# Altium project Servo-Board-v1.0.PrjPcb (part 3 of 19)

## Sheet RJ45_Sheet.SchDoc
size 420 x 297 mm; SheetNumber: 6; SheetTotal: 32
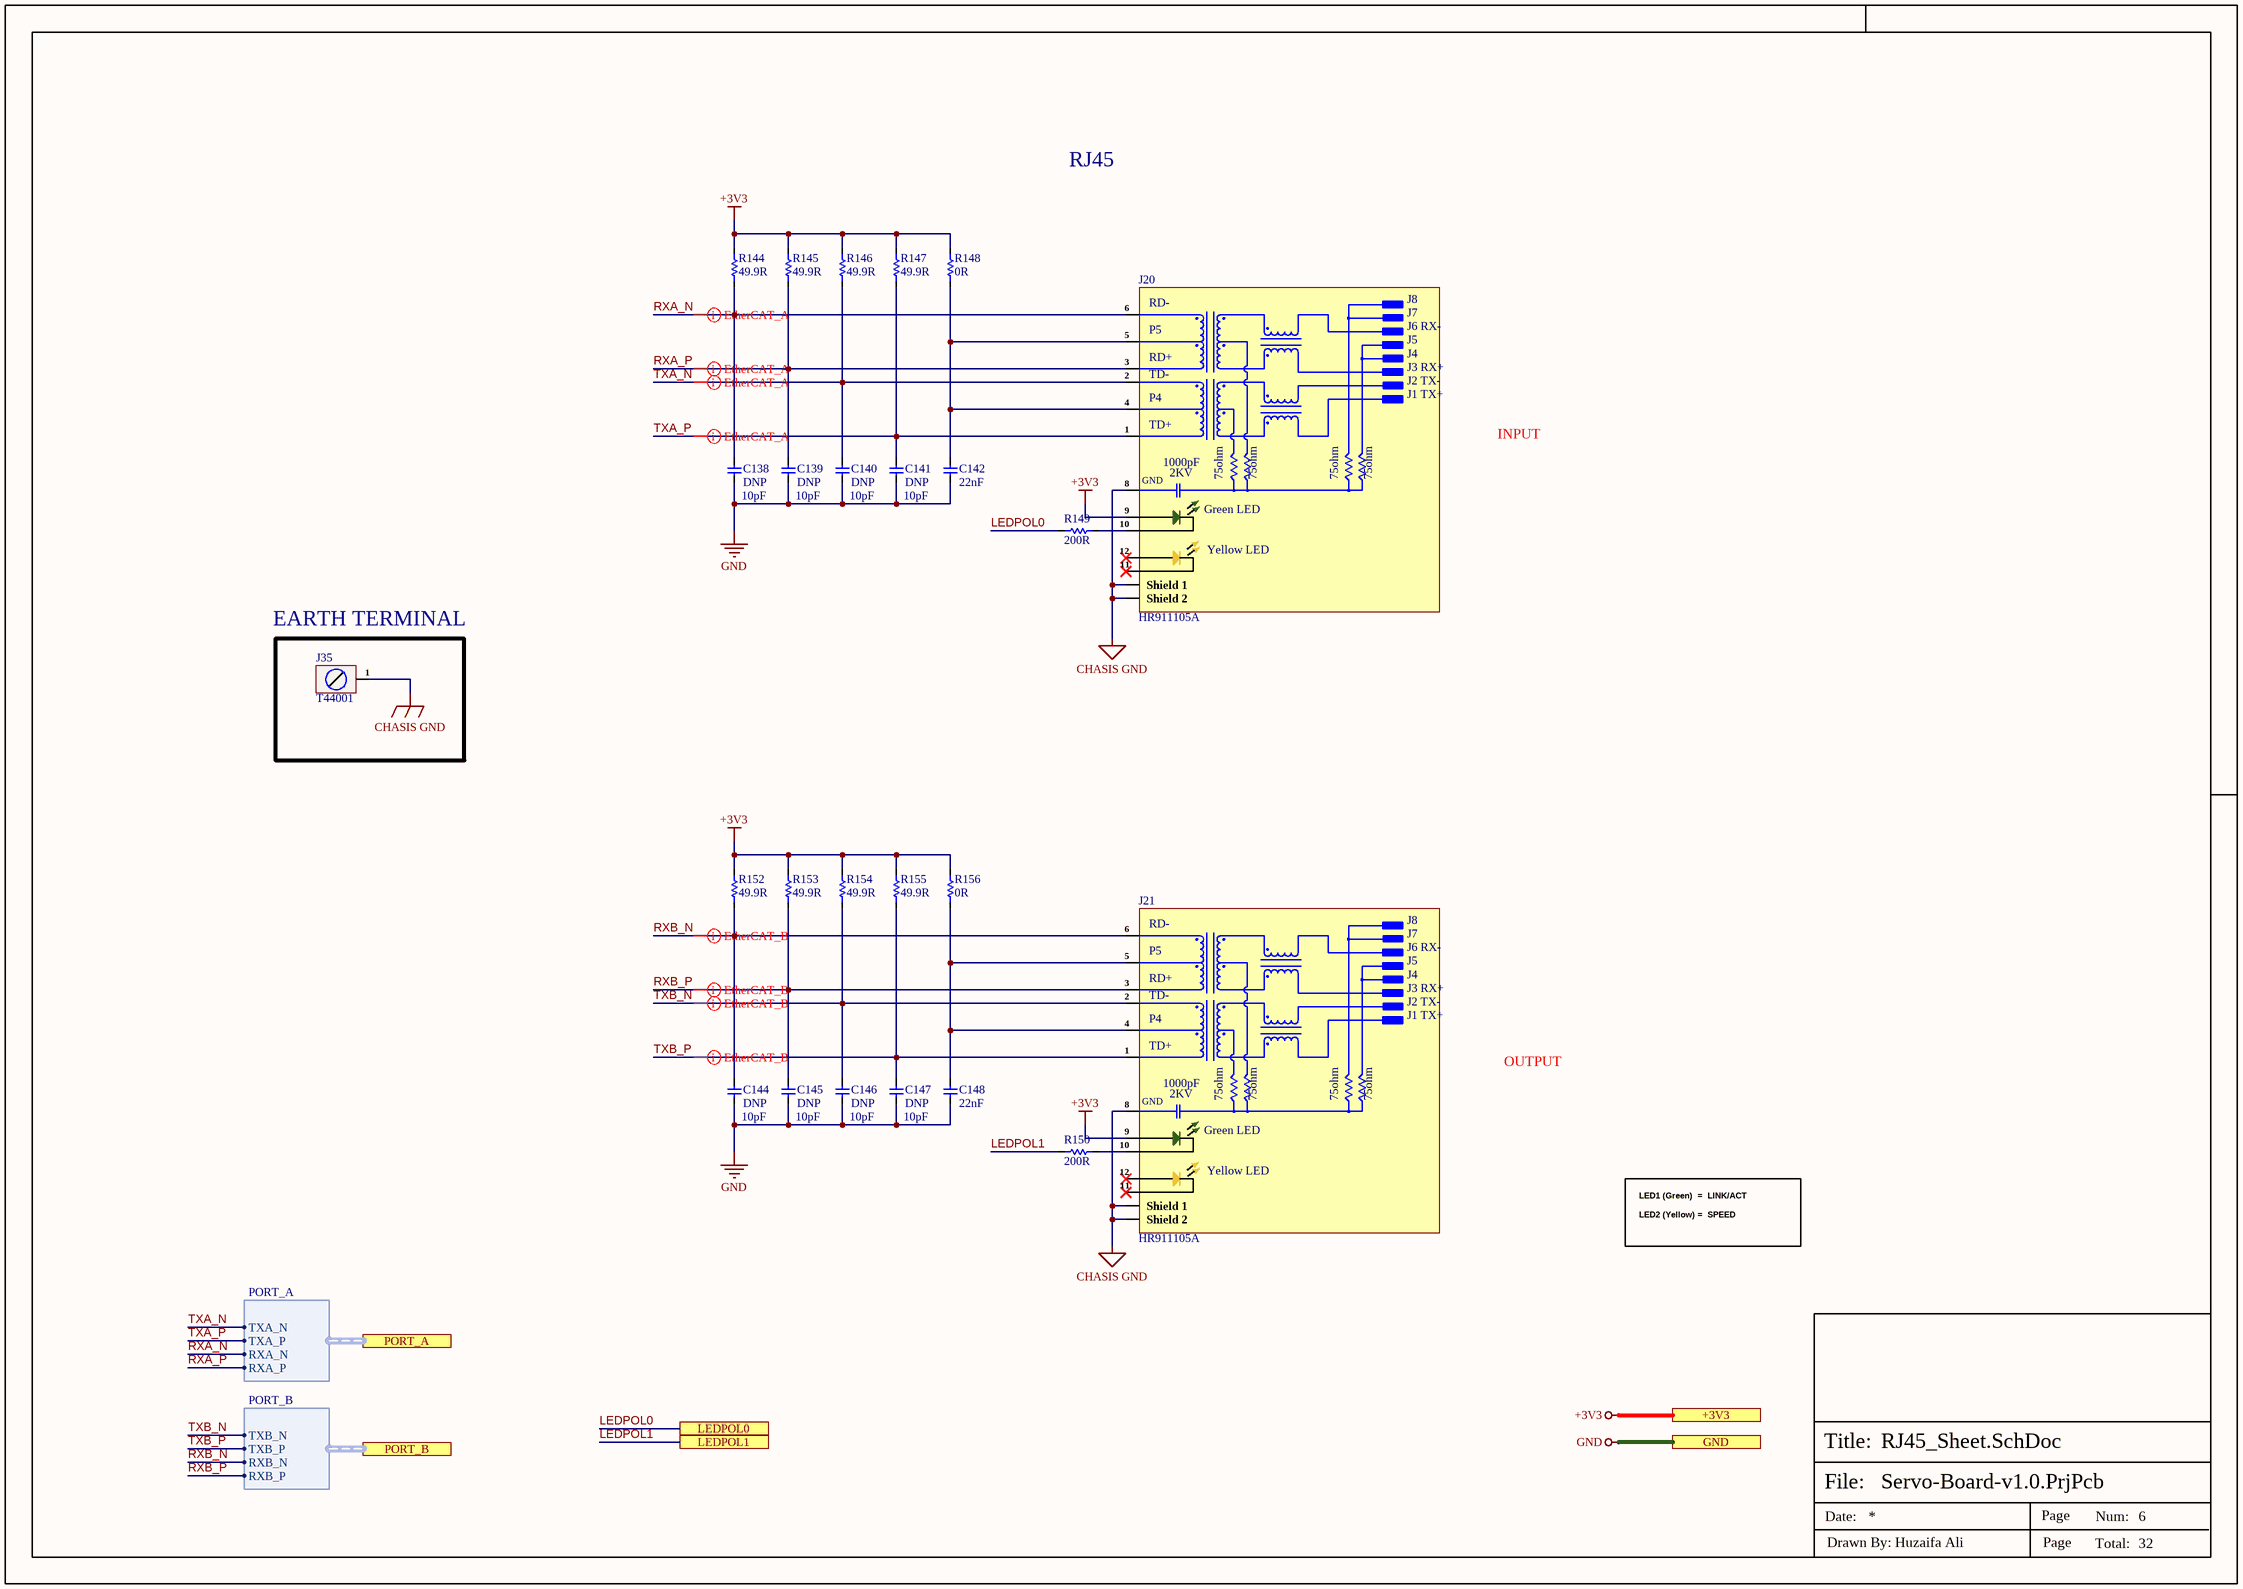
[diagram p5: RJ45_Sheet.SchDoc]

### Parts
C138  DNP  [Cap-0402]
C139  DNP  [Cap-0402]
C140  DNP  [Cap-0402]
C141  DNP  [Cap-0402]
C142  22nF  [Cap-0402]
C144  DNP  [Cap-0402]
C145  DNP  [Cap-0402]
C146  DNP  [Cap-0402]
C147  DNP  [Cap-0402]
C148  22nF  [Cap-0402]
J20  HR911105A  [HR911105A]
J21  HR911105A  [HR911105A]
J35  T44001  [T44001]
R144  49.9R  [Res-0603]
R145  49.9R  [Res-0603]
R146  49.9R  [Res-0603]
R147  49.9R  [Res-0603]
R148  0R  [Res-0402]
R149  200R  [Res-0402]
R150  200R  [Res-0402]
R152  49.9R  [Res-0603]
R153  49.9R  [Res-0603]
R154  49.9R  [Res-0603]
R155  49.9R  [Res-0603]
R156  0R  [Res-0402]

### Ports
+3V3 (see Top_Sheet[2C], CAN_Sheet[5D], Connector_Sheet[5D], Controller_Sheet[5D], Encoder_Sheet1[5D], Encoder_Sheet2[5D], Encoder_Sheet3[5D], Encoder_Sheet4[5D], EtherCAT_Sheet[5D], Motor_Driver_Sheet1[5D], Motor_Driver_Sheet2[5D], Motor_Driver_Sheet3[5D], Motor_Driver_Sheet4[5D], Power_Sheet[5D], RS485_RS232_Sheet[3D], Sec_Controller_Sheet1[5D], Sec_Controller_Sheet2[5D], Sec_Controller_Sheet3[5D], Sec_Controller_Sheet4[5D]), GND (see Top_Sheet[2C], CAN_Sheet[5D], Connector_Sheet[5D], Controller_Sheet[5D], DIO_1[5D], DIO_2[5D], DIO_3[5D], DIO_4[5D], Encoder_Sheet1[5D], Encoder_Sheet2[5D], Encoder_Sheet3[5D], Encoder_Sheet4[5D], EtherCAT_Sheet[5D], MOSFET_Driver_Sheet1[5D], MOSFET_Driver_Sheet2[5D], MOSFET_Driver_Sheet3[5D], MOSFET_Driver_Sheet4[5D], Motor_Driver_Sheet1[5D], Motor_Driver_Sheet2[5D], Motor_Driver_Sheet3[5D], Motor_Driver_Sheet4[5D], Power_Sheet[5D], RS485_RS232_Sheet[3D], Sec_Controller_Sheet1[5D], Sec_Controller_Sheet2[5D], Sec_Controller_Sheet3[5D], Sec_Controller_Sheet4[5D]), LEDPOL0 (see Top_Sheet[2D], EtherCAT_Sheet[1D]), LEDPOL1 (see Top_Sheet[2D], EtherCAT_Sheet[1D]), PORT_A (harness PORT_A, see Top_Sheet[2D], EtherCAT_Sheet[2D]), PORT_B (harness PORT_B, see Top_Sheet[2D], EtherCAT_Sheet[2D])

### Harnesses
PORT_A: TXA_N, TXA_P, RXA_N, RXA_P
PORT_B: TXB_N, TXB_P, RXB_N, RXB_P

### Nets
+3V3: J20.9(ANODE) J21.9(ANODE) R144.2 R145.2 R146.2 R147.2 R148.2 R152.2 R153.2 R154.2 R155.2 R156.2 ; port +3V3
CHASIS GND: J20.8(GND) J20.Shield_1 J20.Shield_2 J21.8(GND) J21.Shield_1 J21.Shield_2 J35.1
GND: C138.1 C139.1 C140.1 C141.1 C142.1 C144.1 C145.1 C146.1 C147.1 C148.1 ; port GND
LEDPOL0: R149.1 ; port LEDPOL0
LEDPOL1: R150.1 ; port LEDPOL1
RXA_N: C138.2 J20.6(RD-) R144.1 ; port PORT_A.RXA_N
RXA_P: C139.2 J20.3(RD+) R145.1 ; port PORT_A.RXA_P
RXB_N: C144.2 J21.6(RD-) R152.1 ; port PORT_B.RXB_N
RXB_P: C145.2 J21.3(RD+) R153.1 ; port PORT_B.RXB_P
TXA_N: C140.2 J20.2(TD-) R146.1 ; port PORT_A.TXA_N
TXA_P: C141.2 J20.1(TD+) R147.1 ; port PORT_A.TXA_P
TXB_N: C146.2 J21.2(TD-) R154.1 ; port PORT_B.TXB_N
TXB_P: C147.2 J21.1(TD+) R155.1 ; port PORT_B.TXB_P
NetC142_2: C142.2 J20.4(P4) J20.5(P5) R148.1
NetC148_2: C148.2 J21.4(P4) J21.5(P5) R156.1
NetJ20_10: J20.10(CATHODE) R149.2
NetJ21_10: J21.10(CATHODE) R150.2

Not connected (* = marked no-connect by the designer): J20 11(CATHODE)* 12(ANODE_)*; J21 11(CATHODE)* 12(ANODE_)*

### Layout directives
differential pair; differential pair class EtherCAT_B_Lines; net class EtherCAT_B; rule Matched Net Lengths [Tolerance = 25.4mil]; rule Impedance Constraint [Min = 85.00    Max = 95.00    ]: RXB_N, RXB_P, TXB_N, TXB_P
differential pair; differential pair class EtherCAT_A_Lines; net class EtherCAT_A; rule Matched Net Lengths [Tolerance = 25.4mil]; rule Impedance Constraint [Min = 85.00    Max = 95.00    ]: RXA_N, RXA_P, TXA_N, TXA_P

### Notes on the sheet
- RJ45
- INPUT
- 10pF
- (near J35) EARTH TERMINAL
- OUTPUT
- LED1 (Green)  =  LINK/ACT
  LED2 (Yellow) =  SPEED
- File:
- Title:
- Date:
- Page
- Num:
- Total:
- Drawn By: Huzaifa Ali
- (in symbol HR911105A) J8; J7; J6 RX-; J5; J4; J3 RX+; J2 TX-; J1 TX+; 1000pF; 2KV; 75ohm; Green LED; Yellow LED

### Library data of the parts
C138-C141 C144-C147 = GRM1555C1H100JA01D: CAP CER 10PF 50V C0G/NP0 0402; Manufacturer: Murata; Material: Ceramic; Dielectric: C0G; Tolerance: 5%; Item Type: Capacitor; Supplier: Arrow Electronics; Supplier Part Number: GRM1555C1H100JA01D; Manufacturer Part Number: GRM1555C1H100JA01D; RoHS: Yes; Category: Ceramic Capacitors; Stock: 3860000; Pricing: 10000=0.0034, 50000=0.0027, 100000=0.0023, 250000=0.0021 (USD); Mounting Technology: Surface Mount; Case/Package: 0402; Case Code (Metric): 1005; Case Code (Imperial): 0402; Min Operating Temperature: -55°C; Max Operating Temperature: 125°C; Value: 10pF; Voltage Rating: 50V; Packaging: Tape and Reel; Package Quantity: 1; Voltage Rating (DC): 50V; Termination: SMD/SMT; Series: GRM; Voltage: 50V; Construction: Flat; Length: 1mm; Width: 0.02inch; Height: 0.5mm; Depth: 0.5mm; Thickness: 0.022inch; Radiation Hardening: No; RoHS Compliant: Yes; Lead Free: Lead Free; Reach SVHC Compliant: No; ComponentLink1URL: https://datasheet.ciiva.com/2989/product-2989280.pdf?src-supplier=Avnet; ComponentLink1Description: https://datasheet.ciiva.com/2989/product-2989280.pdf?src-supplier=Avnet; ComponentLink2URL: https://datasheet.ciiva.com/18184/getdatasheetpartid-307234-18184164.pdf?src-supplier=Verical; ComponentLink2Description: https://datasheet.ciiva.com/18184/getdatasheetpartid-307234-18184164.pdf?src-supplier=Verical; ComponentLink3URL: https://datasheet.ciiva.com/29200/453545-da-01-en-vs-kondensator-0402-29200107.pdf?src-supplier=Conrad; ComponentLink3Description: https://datasheet.ciiva.com/29200/453545-da-01-en-vs-kondensator-0402-29200107.pdf?src-supplier=Conrad; ComponentLink4URL: https://datasheet.ciiva.com/7828/1666664-7828812.pdf?src-supplier=Element14; ComponentLink4Description: https://datasheet.ciiva.com/7828/1666664-7828812.pdf?src-supplier=Element14; ComponentLink5URL: https://datasheet.ciiva.com/6271/partnumbering-e-01-6271159.pdf?src-supplier=Digi-Key; ComponentLink5Description: https://datasheet.ciiva.com/6271/partnumbering-e-01-6271159.pdf?src-supplier=Digi-Key; ComponentLink6URL: https://datasheet.ciiva.com/6271/partnumbering-e-01-6271158.pdf?src-supplier=Digi-Key; ComponentLink6Description: https://datasheet.ciiva.com/6271/partnumbering-e-01-6271158.pdf?src-supplier=Digi-Key; ComponentLink7URL: https://datasheet.ciiva.com/6271/partnumbering-e-01-6271068.pdf?src-supplier=Digi-Key; ComponentLink7Description: https://datasheet.ciiva.com/6271/partnumbering-e-01-6271068.pdf?src-supplier=Digi-Key; LCSC Part Number: C76946
C142 C148 = CC0402JRX7R7BB223: CAP CER 0.022UF 16V X7R 0402; Manufacturer: Yageo; Tolerance: 5%; Item Type: Capacitor; Supplier: Digikey; Supplier Part Number: 311-3758-1-ND; Manufacturer Part Number: CC0402JRX7R7BB223; RoHS: Yes; Category: Ceramic Capacitors; Stock: 4203; Pricing: 1=0.1, 10=0.033, 50=0.0192, 100=0.0149, 500=0.0112, 1000=0.0088, 2500=0.008, 5000=0.00736 (USD); Mounting Technology: Surface Mount; Case/Package: 0402; Case Code (Imperial): 0402; Case Code (Metric): 1005; Weight: 2.3E-05oz; Min Operating Temperature: -55°C; Max Operating Temperature: 125°C; Value: 22nF; Packaging: Tape and Reel; Voltage Rating: 16V; Voltage Rating (DC): 16V; Dielectric: X7R; Termination: SMD/SMT; Series: CC; Length: 0.039inch; Width: 0.5mm; Thickness: 0.022inch; RoHS Compliant: Yes; Halogen Free: 5694HalogenFree; Lead Free: 5697LeadFree; ComponentLink1URL: https://datasheet.ciiva.com/13264/upy-gphc-x7r-6-3v-to-50v-8-12304-13264039.pdf?src-supplier=Mouser; ComponentLink1Description: https://datasheet.ciiva.com/13264/upy-gphc-x7r-6-3v-to-50v-8-12304-13264039.pdf?src-supplier=Mouser; LCSC Part Number: C541459
J20 J21 = HR911105A: RJ45 RJReceptacle 1 WithLED Plugin Ethernet Connectors/Modular Connectors (RJ45 RJ11) ROHS; Manufacturer: HANRUN; Item Type: RJ45 Connector; Manufacturer Part Number: HR911105A; Package: Plugin; LCSC Part Number: C12074; ComponentLink1Description: LCSC; ComponentLink1URL: https://www.lcsc.com/product-detail/Ethernet-Connectors-Modular-Connectors-RJ45-RJ11_HANRUN-Zhongshan-HanRun-Elec-HR911105A_C12074.html
J35 = T44001: M4 Plugin PCB Welding Terminal ROHS; Manufacturer: XFCN; Manufacturer Part Number: T44001; Package: Plugin; ComponentLink1Description: LCSC; ComponentLink1URL: *
R144-R147 R152-R155 = RC0603FR-0749R9L: RES 49.9 OHM 1% 1/10W 0603; Manufacturer: Yageo; Temperature Coefficient: 100ppm/°C; Voltage Rating (DC): 50V; Power Rating: 100mW; Item Type: Resistor; Supplier 1: Arrow Electronics; Manufacturer Part Number: RC0603FR-0749R9L; RoHS: Yes; Category: Chip SMD Resistors; Stock 1: 2075000; Pricing 1: 5000=0.00280 (USD); Case/Package: 0603; Number of Pins: 2; Case Code (Imperial): 0603; Case Code (Metric): 1608; Size Code: 0603; Min Operating Temperature: -55°C; Max Operating Temperature: 155°C; Tolerance: 1%; Resistance: 49.9R; Resistor Type: Thick Film; Packaging: Tape and Reel; Voltage Rating: 50V; Termination: SMD/SMT; Features: Moisture Resistant; Series: RC; Max Power Dissipation: 100mW; Number of Terminations: 2; Construction: Rectangular; Resistance Tolerance: 1%; Technology: THICK FILM; Length: 1.6mm; Height: 0.45mm; Depth: 0.8mm; Lead Free: Lead Free; REACH SVHC: No SVHC; Military Standard: Not; RoHS Compliant: Yes; ComponentLink1URL: https://datasheet.ciiva.com/11808/0900766b80f96399-11808223.pdf?src-supplier=RSComponents; ComponentLink1Description: https://datasheet.ciiva.com/11808/0900766b80f96399-11808223.pdf?src-supplier=RSComponents; ComponentLink2URL: https://datasheet.ciiva.com/22747/443971-22747527.pdf?src-supplier=Element14; ComponentLink2Description: https://datasheet.ciiva.com/22747/443971-22747527.pdf?src-supplier=Element14; ComponentLink3URL: https://datasheet.ciiva.com/15189/getdatasheetpartid-325421-15189750.pdf?src-supplier=Verical; ComponentLink3Description: https://datasheet.ciiva.com/15189/getdatasheetpartid-325421-15189750.pdf?src-supplier=Verical; Supplier Part Number 1: RC0603FR-0749R9L; LCSC Part Number: C114625
R148 R156 = AC0402FR-070RL: RESISTOR 0402 JUMPER ZERO OHM; Manufacturer: Yageo; Voltage Rating: 50V; Power Rating: 62.5mW; Tolerance: 1%; Temperature Coefficient: 200ppm/°C; Supplier: Digi-Key; Supplier Part Number: 13-AC0402FR-070RLDKR-ND; Manufacturer Part Number: AC0402FR-070RL; RoHS: Yes; Category: Chip SMD Resistors; Stock: 337140; Pricing: 1=0.1, 10=0.017, 25=0.0132, 50=0.01, 100=0.0071, 250=0.00568, 500=0.00454, 1000=0.00335, 5000=0.0024 (USD); Case/Package: 0402; Case Code (Imperial): 0402; Case Code (Metric): 1005; Min Operating Temperature: -55°C; Max Operating Temperature: 155°C; Value: 0R; Packaging: Tape and Reel; Termination: SMD/SMT; Series: AC; Height: 370um; ComponentLink1URL: https://datasheet.ciiva.com/12656/pyu-ac-51-rohs-l-2-12656734.pdf?src-supplier=Mouser; ComponentLink1Description: https://datasheet.ciiva.com/12656/pyu-ac-51-rohs-l-2-12656734.pdf?src-supplier=Mouser; LCSC Part Number: C226739; Item Type: Resistor; ComponentLink2Description: LCSC; ComponentLink2URL: https://www.lcsc.com/product-detail/Chip-Resistor-Surface-Mount_YAGEO-AC0402FR-070RL_C226739.html
R149 R150 = RC0402FR-07200RL: as R17 on sheet Power_Sheet; Supplier 1: Digi-Key; Manufacturer Part Number: RC0402FR-07200RL; RoHS: Yes; Category: Chip SMD Resistors; Stock 1: 19778; Pricing 1: 1=0.10000, 10=0.01600, 100=0.00660, 1000=0.00299, 2500=0.00259, 5000=0.00214 (USD); Case/Package: 0402; Case Code (Metric): 1005; Case Code (Imperial): 0402; Size Code: 0402; Min Operating Temperature: -55°C; Max Operating Temperature: 155°C; Tolerance: 1%; Resistance: 200R; Resistor Type: Thick Film; Packaging: Tape and Reel; Voltage Rating: 50V; Package Quantity: 1; Number of Terminations: 2; Termination: SMD/SMT; Max Power Dissipation: 63mW; Features: Moisture Resistant; Series: RC; Construction: Rectangular; Resistance Tolerance: 1%; Length: 1mm; Width: 0.02inch; Height: 0.016inch; Depth: 0.5mm; REACH SVHC: No SVHC; Lead Free: Lead Free; RoHS Compliant: Yes; Military Standard: Not; ComponentLink1URL: https://datasheet.ciiva.com/2553/pyu-r-int-thick-7-2553232.pdf?src-supplier=Digi-Key; ComponentLink1Description: https://datasheet.ciiva.com/2553/pyu-r-int-thick-7-2553232.pdf?src-supplier=Digi-Key; ComponentLink2URL: https://datasheet.ciiva.com/7983/1018594-7983509.pdf?src-supplier=Element14; ComponentLink2Description: https://datasheet.ciiva.com/7983/1018594-7983509.pdf?src-supplier=Element14; ComponentLink3URL: https://datasheet.ciiva.com/16804/pyu-rc0402-51-rohs-l-6-r-16804406.pdf?src-supplier=Future+Electronics; ComponentLink3Description: https://datasheet.ciiva.com/16804/pyu-rc0402-51-rohs-l-6-r-16804406.pdf?src-supplier=Future+Electronics; ComponentLink4URL: https://datasheet.ciiva.com/15189/getdatasheetpartid-331152-15189383.pdf?src-supplier=Verical; ComponentLink4Description: https://datasheet.ciiva.com/15189/getdatasheetpartid-331152-15189383.pdf?src-supplier=Verical; ComponentLink5URL: https://datasheet.ciiva.com/7849/1018594-7849898.pdf?src-supplier=Element14; ComponentLink5Description: https://datasheet.ciiva.com/7849/1018594-7849898.pdf?src-supplier=Element14; ComponentLink6URL: https://datasheet.ciiva.com/5562/pyu-rc0402-51-rohs-l-6-r-8721-5562539.pdf?src-supplier=Mouser; ComponentLink6Description: https://datasheet.ciiva.com/5562/pyu-rc0402-51-rohs-l-6-r-8721-5562539.pdf?src-supplier=Mouser; ComponentLink7URL: https://datasheet.ciiva.com/7849/1018594-7849899.pdf?src-supplier=Element14; ComponentLink7Description: https://datasheet.ciiva.com/7849/1018594-7849899.pdf?src-supplier=Element14; ComponentLink8URL: https://datasheet.ciiva.com/2553/pyu-r-int-thick-7-2553230.pdf?src-supplier=Digi-Key; ComponentLink8Description: https://datasheet.ciiva.com/2553/pyu-r-int-thick-7-2553230.pdf?src-supplier=Digi-Key; ComponentLink9URL: https://datasheet.ciiva.com/2553/pyu-r-int-thick-7-2553231.pdf?src-supplier=Digi-Key; ComponentLink9Description: https://datasheet.ciiva.com/2553/pyu-r-int-thick-7-2553231.pdf?src-supplier=Digi-Key; Supplier Part Number 1: 311-200LRCT-ND; LCSC Part Number: C114764

## Sheet EtherCAT_Sheet.SchDoc
size 420 x 297 mm; SheetNumber: 7; SheetTotal: 32
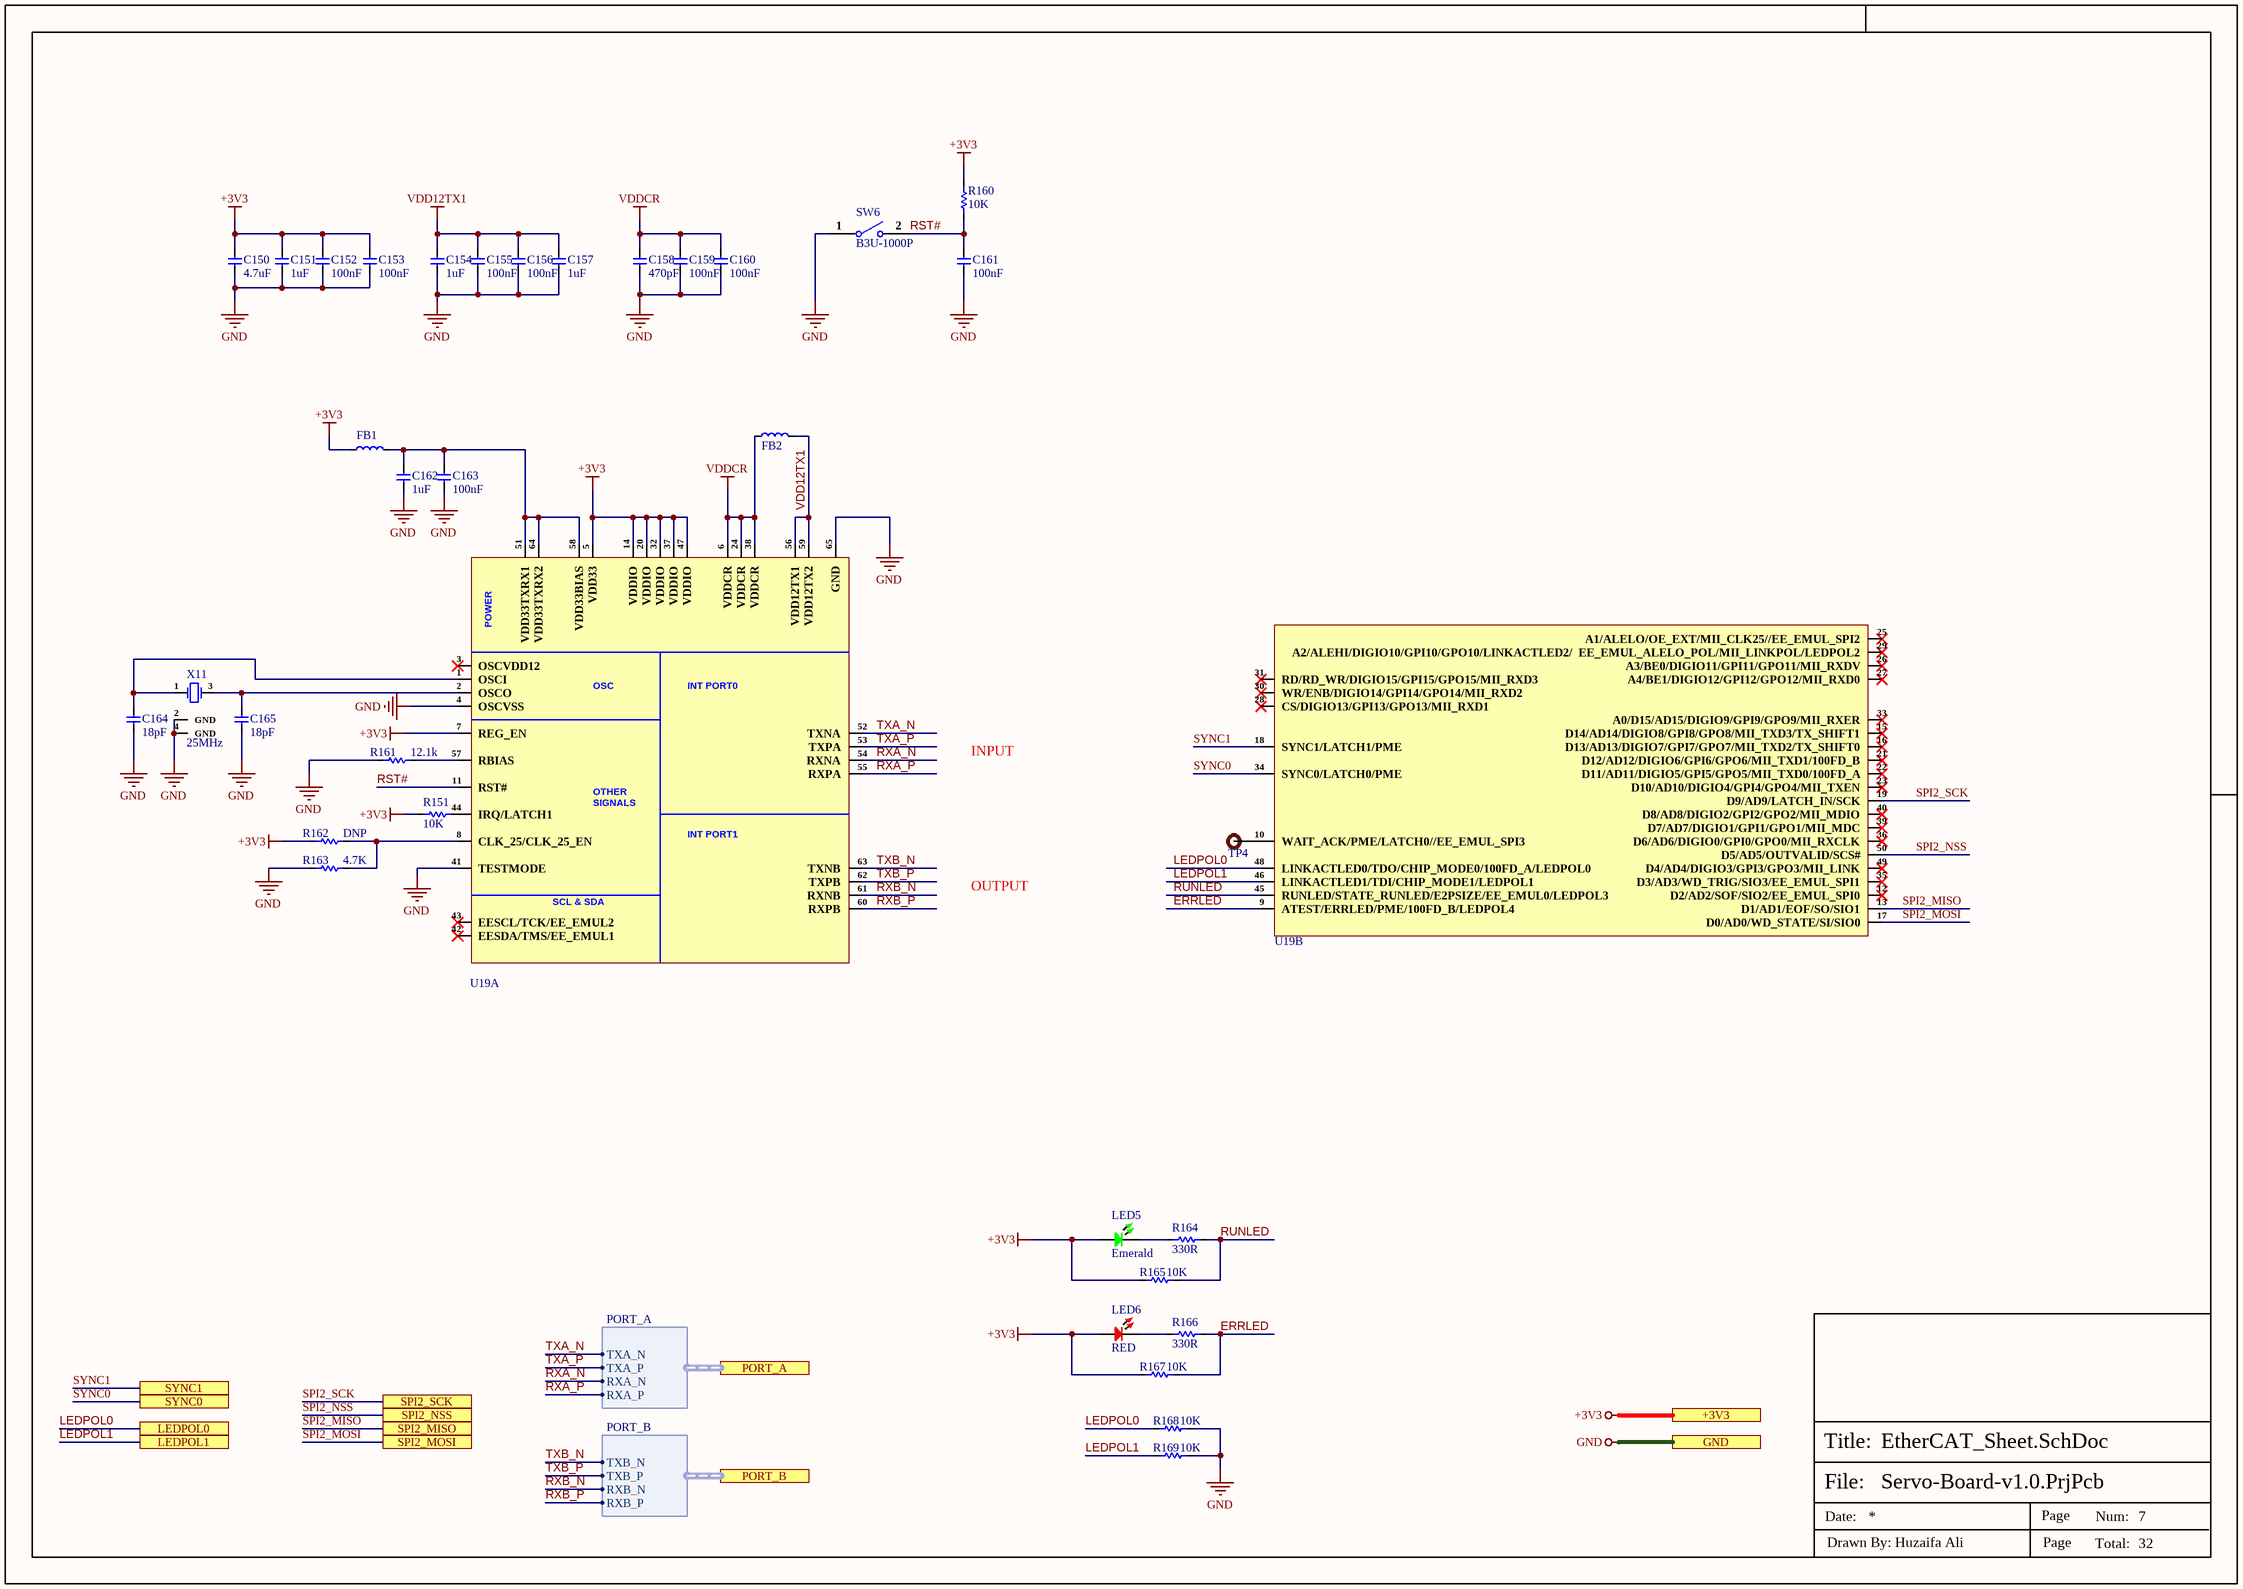
[diagram p6: EtherCAT_Sheet.SchDoc]

### Parts
C150  4.7uF  [Cap-0402]
C151  1uF  [Cap-0402]
C152  100nF  [cap-0402]
C153  100nF  [cap-0402]
C154  1uF  [Cap-0402]
C155  100nF  [cap-0402]
C156  100nF  [cap-0402]
C157  1uF  [Cap-0402]
C158  470pF  [Cap-0603]
C159  100nF  [cap-0402]
C160  100nF  [cap-0402]
C161  100nF  [cap-0402]
C162  1uF  [Cap-0402]
C163  100nF  [cap-0402]
C164  18pF  [Cap-0402]
C165  18pF  [Cap-0402]
FB1  BLM15PG100SN1D  [IND-0402]  (value not drawn)
FB2  BLM15PG100SN1D  [IND-0402]  (value not drawn)
LED5  Emerald  [LED-0603]
LED6  RED  [LED-0603]
R151  10K  [Res-0402]
R160  10K  [Res-0402]
R161  12.1k  [Res-0402]
R162  DNP  [Res-0402]
R163  4.7K  [Res-0402]
R164  330R  [Res-0603]
R165  10K  [Res-0402]
R166  330R  [Res-0603]
R167  10K  [Res-0402]
R168  10K  [Res-0402]
R169  10K  [Res-0402]
SW6  B3U-1000P  [B3U-1000P]
TP4  TEST POINT  [Test-point]  (value not drawn)  (no BOM)
U19  LAN9253-SVB QFN64  [QFN-64-EP(9x9)]  (value not drawn)  (parts A,B of 2)
X11  25MHz  [SMD3225-4P]

### Ports
+3V3 (see Top_Sheet[1C], CAN_Sheet[5D], Connector_Sheet[5D], Controller_Sheet[5D], Encoder_Sheet1[5D], Encoder_Sheet2[5D], Encoder_Sheet3[5D], Encoder_Sheet4[5D], Motor_Driver_Sheet1[5D], Motor_Driver_Sheet2[5D], Motor_Driver_Sheet3[5D], Motor_Driver_Sheet4[5D], Power_Sheet[5D], RJ45_Sheet[5D], RS485_RS232_Sheet[3D], Sec_Controller_Sheet1[5D], Sec_Controller_Sheet2[5D], Sec_Controller_Sheet3[5D], Sec_Controller_Sheet4[5D]), GND (see Top_Sheet[1C], CAN_Sheet[5D], Connector_Sheet[5D], Controller_Sheet[5D], DIO_1[5D], DIO_2[5D], DIO_3[5D], DIO_4[5D], Encoder_Sheet1[5D], Encoder_Sheet2[5D], Encoder_Sheet3[5D], Encoder_Sheet4[5D], MOSFET_Driver_Sheet1[5D], MOSFET_Driver_Sheet2[5D], MOSFET_Driver_Sheet3[5D], MOSFET_Driver_Sheet4[5D], Motor_Driver_Sheet1[5D], Motor_Driver_Sheet2[5D], Motor_Driver_Sheet3[5D], Motor_Driver_Sheet4[5D], Power_Sheet[5D], RJ45_Sheet[5D], RS485_RS232_Sheet[3D], Sec_Controller_Sheet1[5D], Sec_Controller_Sheet2[5D], Sec_Controller_Sheet3[5D], Sec_Controller_Sheet4[5D]), LEDPOL0 (see Top_Sheet[2D], RJ45_Sheet[2D]), LEDPOL1 (see Top_Sheet[2D], RJ45_Sheet[2D]), PORT_A (harness PORT_A, see Top_Sheet[2D], RJ45_Sheet[1D]), PORT_B (harness PORT_B, see Top_Sheet[2D], RJ45_Sheet[1D]), SPI2_MISO (see Top_Sheet[1C], Controller_Sheet[3D]), SPI2_MOSI (see Top_Sheet[1C], Controller_Sheet[3D]), SPI2_NSS (see Top_Sheet[1C], Controller_Sheet[3D]), SPI2_SCK (see Top_Sheet[1C], Controller_Sheet[3D]), SYNC0 (see Top_Sheet[2C]), SYNC1 (see Top_Sheet[2C])

### Harnesses
PORT_A: TXA_N, TXA_P, RXA_N, RXA_P
PORT_B: TXB_N, TXB_P, RXB_N, RXB_P

### Nets
+3V3: C150.2 C151.2 C152.2 C153.2 FB1.1 LED5.1 LED6.1 R151.1 R160.1 R162.1 R165.2 R167.2 U19.5(VDD33) U19.7(REG_EN) U19.14(VDDIO) U19.20(VDDIO) U19.32(VDDIO) U19.37(VDDIO) U19.47(VDDIO) ; port +3V3
GND: C150.1 C151.1 C152.1 C153.1 C154.1 C155.1 C156.1 C157.1 C158.1 C159.1 C160.1 C161.1 C162.1 C163.1 C164.2 C165.2 R161.1 R163.1 R168.1 R169.1 SW6.1 U19.4(OSCVSS) U19.41(TESTMODE) U19.65(GND) X11.2(GND) X11.4(GND) ; port GND
VDD12TX1: C154.2 C155.2 C156.2 C157.2 FB2.2 U19.56(VDD12TX1) U19.59(VDD12TX2)
VDDCR: C158.2 C159.2 C160.2 FB2.1 U19.6(VDDCR) U19.24(VDDCR) U19.38(VDDCR)
ERRLED: R166.2 R167.1 U19.9(ATEST/ERRLED/PME/100FD_B/LEDPOL4)
LEDPOL0: R168.2 U19.48(LINKACTLED0/TDO/CHIP_MODE0/100FD_A/LEDPOL0) ; port LEDPOL0
LEDPOL1: R169.2 U19.46(LINKACTLED1/TDI/CHIP_MODE1/LEDPOL1) ; port LEDPOL1
RST#: C161.2 R160.2 SW6.2 U19.11(RST#)
RUNLED: R164.2 R165.1 U19.45(RUNLED/STATE_RUNLED/E2PSIZE/EE_EMUL0/LEDPOL3)
RXA_N: U19.54(RXNA) ; port PORT_A.RXA_N
RXA_P: U19.55(RXPA) ; port PORT_A.RXA_P
RXB_N: U19.61(RXNB) ; port PORT_B.RXB_N
RXB_P: U19.60(RXPB) ; port PORT_B.RXB_P
SPI2_MISO: U19.13(D1/AD1/EOF/SO/SIO1) ; port SPI2_MISO
SPI2_MOSI: U19.17(D0/AD0/WD_STATE/SI/SIO0) ; port SPI2_MOSI
SPI2_NSS: U19.50(D5/AD5/OUTVALID/SCS#) ; port SPI2_NSS
SPI2_SCK: U19.19(D9/AD9/LATCH_IN/SCK) ; port SPI2_SCK
SYNC0: U19.34(SYNC0/LATCH0/PME) ; port SYNC0
SYNC1: U19.18(SYNC1/LATCH1/PME) ; port SYNC1
TXA_N: U19.52(TXNA) ; port PORT_A.TXA_N
TXA_P: U19.53(TXPA) ; port PORT_A.TXA_P
TXB_N: U19.63(TXNB) ; port PORT_B.TXB_N
TXB_P: U19.62(TXPB) ; port PORT_B.TXB_P
NetC162_2: C162.2 C163.2 FB1.2 U19.51(VDD33TXRX1) U19.58(VDD33BIAS) U19.64(VDD33TXRX2)
NetC164_1: C164.1 U19.1(OSCI) X11.1(CRYSTAL)
NetC165_1: C165.1 U19.2(OSCO) X11.3(CRYSTAL)
NetLED5_2: LED5.2 R164.1
NetLED6_2: LED6.2 R166.1
NetR151_2: R151.2 U19.44(IRQ/LATCH1)
NetR161_2: R161.2 U19.57(RBIAS)
NetR162_2: R162.2 R163.2 U19.8(CLK_25/CLK_25_EN)
NetTP4_1: TP4.1 U19.10(WAIT_ACK/PME/LATCH0//EE_EMUL_SPI3)

Not connected (* = marked no-connect by the designer): U19 3(OSCVDD12)* 12(D2/AD2/SOF/SIO2/EE_EMUL_SPI0)* 15(D14/AD14/DIGIO8/GPI8/GPO8/MII_TXD3/TX_SHIFT1)* 16(D13/AD13/DIGIO7/GPI7/GPO7/MII_TXD2/TX_SHIFT0)* 21(D12/AD12/DIGIO6/GPI6/GPO6/MII_TXD1/100FD_B)* 22(D11/AD11/DIGIO5/GPI5/GPO5/MII_TXD0/100FD_A)* 23(D10/AD10/DIGIO4/GPI4/GPO4/MII_TXEN)* 25(A1/ALELO/OE_EXT/MII_CLK25//EE_EMUL_SPI2)* 26(A3/BE0/DIGIO11/GPI11/GPO11/MII_RXDV)* 27(A4/BE1/DIGIO12/GPI12/GPO12/MII_RXD0)* 28(CS/DIGIO13/GPI13/GPO13/MII_RXD1)* 29(A2/ALEHI/DIGIO10/GPI10/GPO10/LINKACTLED2/__EE_EMUL_ALELO_POL/MII_LINKPOL/LEDPOL2)* 30(WR/ENB/DIGIO14/GPI14/GPO14/MII_RXD2)* 31(RD/RD_WR/DIGIO15/GPI15/GPO15/MII_RXD3)* 33(A0/D15/AD15/DIGIO9/GPI9/GPO9/MII_RXER)* 35(D3/AD3/WD_TRIG/SIO3/EE_EMUL_SPI1)* 36(D6/AD6/DIGIO0/GPI0/GPO0/MII_RXCLK)* 39(D7/AD7/DIGIO1/GPI1/GPO1/MII_MDC)* 40(D8/AD8/DIGIO2/GPI2/GPO2/MII_MDIO)* 42(EESDA/TMS/EE_EMUL1)* 43(EESCL/TCK/EE_EMUL2)* 49(D4/AD4/DIGIO3/GPI3/GPO3/MII_LINK)*

### Notes on the sheet
- INPUT
- OUTPUT
- File:
- Title:
- Date:
- Page
- Num:
- Total:
- Drawn By: Huzaifa Ali
- (in symbol LAN9253-SVB QFN64, part A) POWER; OSC; INT PORT0; OTHER / SIGNALS; INT PORT1; SCL & SDA

### Library data of the parts
C150 = CC0402KRX5R6BB475: as C10 on sheet Controller_Sheet; Supplier 1: Farnell; Manufacturer Part Number: CC0402KRX5R6BB475; RoHS: Yes; Category: Ceramic Capacitors; Stock 1: 20000; Pricing 1: 10000=0.02310, 50000=0.02100 (GBP); Mount: Surface Mount; Case/Package: 0402; Case Code (Imperial): 0402; Case Code (Metric): 1005; Min Operating Temperature: -55°C; Max Operating Temperature: 85°C; Packaging: Cut Tape; Capacitance: 4.7uF; Voltage Rating: 10V; RoHS Compliant: Yes; ComponentLink1URL: http://www.yageo.com/documents/recent/UPY-GPHC_X5R_4V-to-50V_25.pdf?src-supplier=Digi-Key; ComponentLink1Description: http://www.yageo.com/documents/recent/UPY-GPHC_X5R_4V-to-50V_25.pdf?src-supplier=Digi-Key; Supplier Part Number 1: 3871698; LCSC Part Number: C326586
C151 C154 C157 C162 = CC0402KRX5R6BB105: CAP CER 1UF 10V X5R 0402; Manufacturer: Yageo; Tolerance: 10%; Dissipation Factor: 15%; Item Type: Capacitor; Supplier 1: Mouser; Manufacturer Part Number: CC0402KRX5R6BB105; RoHS: Yes; Category: Ceramic Capacitors; Stock 1: 6711367; Pricing 1: 1=0.11000, 10=0.05500, 50=0.05500, 100=0.03300, 500=0.02700, 1000=0.02200, 2500=0.02100, 10000=0.01800 (USD); Mount: Surface Mount; Case/Package: 0402; Number of Pins: 2; Case Code (Metric): 1005; Case Code (Imperial): 0402; Min Operating Temperature: -55°C; Max Operating Temperature: 85°C; Capacitance: 1uF; Dielectric: X5R; Package Quantity: 1; Voltage Rating: 10V; Packaging: Tape and Reel; Voltage Rating (DC): 10V; Termination: SMD/SMT; Resistor Type: Ceramic; Series: CC; Construction: Flat; Length: 1mm; Width: 0.02inch; Height: 0.5mm; Thickness: 0.022inch; Depth: 0.5mm; Radiation Hardening: No; REACH SVHC: No SVHC; Lead Free: Lead Free; Halogen Free: Halogen Free; RoHS Compliant: Yes; ComponentLink1URL: https://datasheet.ciiva.com/176/upy-gphc-x5r-4v-to-50v-12-176704.pdf?src-supplier=Digi-Key; ComponentLink1Description: https://datasheet.ciiva.com/176/upy-gphc-x5r-4v-to-50v-12-176704.pdf?src-supplier=Digi-Key; ComponentLink2URL: https://datasheet.ciiva.com/176/mlccorderingcode-176705.pdf?src-supplier=Digi-Key; ComponentLink2Description: https://datasheet.ciiva.com/176/mlccorderingcode-176705.pdf?src-supplier=Digi-Key; ComponentLink3URL: https://datasheet.ciiva.com/176/mlccorderingcode-176706.pdf?src-supplier=Digi-Key; ComponentLink3Description: https://datasheet.ciiva.com/176/mlccorderingcode-176706.pdf?src-supplier=Digi-Key; Supplier Part Number 1: 603-CC402KRX5R6BB105; LCSC Part Number: C106254
C152 C153 C155 C156 C159-C161 C163 = C1005X7R1H104KT000F: as C11 on sheet Controller_Sheet; Supplier 1: Avnet; Manufacturer Part Number: C1005X7R1H104KT000F; RoHS: No; Category: Ceramic Capacitors; Dielectric: X7R; Supplier Part Number 1: C1005X7R1H104KT000F; LCSC Part Number: C361198; ComponentLink1Description: LCSC; ComponentLink1URL: https://www.lcsc.com/product-detail/Multilayer-Ceramic-Capacitors-MLCC-SMD-SMT_TDK-C1005X7R1H104KT000F_C361198.html
C158 = 0603B471K500CT: CAP CER 470PF 50V X7R 0603; Manufacturer: Walsin Technologies; Tolerance: 10%; Item Type: Capacitor; Supplier 1: Arrow Electronics; Manufacturer Part Number: 0603B471K500CT; RoHS: Yes; Category: Ceramic Capacitors; Stock 1: 136000; Pricing 1: 4000=0.00550, 8000=0.00460, 12000=0.00440, 40000=0.00430 (USD); Case/Package: Ceramic; Case Code (Metric): 1608; Case Code (Imperial): 0603; Min Operating Temperature: -55°C; Max Operating Temperature: 125°C; Capacitance: 470pF; Packaging: Tape and Reel; Dielectric: X7R; Voltage Rating: 50V; Voltage Rating (DC): 50V; Length: 1.6mm; Depth: 0.8mm; Radiation Hardening: No; RoHS Compliant: Yes; REACH SVHC: Unknown; Lead Free: Lead Free; ComponentLink1URL: https://www.verical.com/server-webapp/html/getDatasheet?partID=467798&src-supplier=Verical; ComponentLink1Description: https://www.verical.com/server-webapp/html/getDatasheet?partID=467798&src-supplier=Verical; ComponentLink2URL: http://www.farnell.com/datasheets/2340522.pdf?src-supplier=Farnell; ComponentLink2Description: http://www.farnell.com/datasheets/2340522.pdf?src-supplier=Farnell; ComponentLink3URL: http://www.passivecomponent.com/indexsea/0603B471K500CT-IS.pdf?src-supplier=Digi-Key; ComponentLink3Description: http://www.passivecomponent.com/indexsea/0603B471K500CT-IS.pdf?src-supplier=Digi-Key; ComponentLink4URL: http://www.passivecomponent.com/wp-content/uploads/2018/10/MLCC.pdf?src-supplier=Digi-Key; ComponentLink4Description: http://www.passivecomponent.com/wp-content/uploads/2018/10/MLCC.pdf?src-supplier=Digi-Key; ComponentLink5URL: http://www.farnell.com/datasheets/1958513.pdf?src-supplier=Element14; ComponentLink5Description: http://www.farnell.com/datasheets/1958513.pdf?src-supplier=Element14; ComponentLink6URL: http://www.farnell.com/datasheets/2340522.pdf?src-supplier=Newark; ComponentLink6Description: http://www.farnell.com/datasheets/2340522.pdf?src-supplier=Newark; Supplier Part Number 1: 0603B471K500CT; LCSC Part Number: C93192
C164 C165 = GCM1555C1H180GA16D: CAP CER 18PF 50V C0G/NP0 0402; Manufacturer: Murata; Tolerance: 2%; Item Type: Capacitor; Supplier: Rs; Supplier Part Number: 2477793P; Manufacturer Part Number: GCM1555C1H180GA16D; RoHS: Yes; Category: Ceramic Capacitors; Stock: 10000; Pricing: 500=0.013, 5000=0.009 (GBP); Mounting Technology: Surface Mount; Case/Package: 0402; Case Code (Imperial): 0402; Case Code (Metric): 1005; Min Operating Temperature: -55°C; Max Operating Temperature: 125°C; Packaging: Cut Tape; Value: 18pF; Voltage Rating: 50V; Series: GCM; Ratings: AEC-Q200; RoHS Compliant: Yes; ComponentLink1URL: http://search.murata.co.jp/Ceramy/image/img/A01X/G101/ENG/GCM1555C1H180GA16-01.pdf?src-supplier=Digi-Key; ComponentLink1Description: http://search.murata.co.jp/Ceramy/image/img/A01X/G101/ENG/GCM1555C1H180GA16-01.pdf?src-supplier=Digi-Key; ComponentLink2URL: https://search.murata.co.jp/Ceramy/image/img/A01X/G101/ENG/GCM1555C1H180GA16-01.pdf?src-supplier=Digi-Key; ComponentLink2Description: https://search.murata.co.jp/Ceramy/image/img/A01X/G101/ENG/GCM1555C1H180GA16-01.pdf?src-supplier=Digi-Key; ComponentLink3URL: https://datasheet.octopart.com/GCM1555C1H180GA16D-Murata-datasheet-149522315.pdf?src-supplier=Newark; ComponentLink3Description: https://datasheet.octopart.com/GCM1555C1H180GA16D-Murata-datasheet-149522315.pdf?src-supplier=Newark; ComponentLink4URL: https://datasheet.octopart.com/GCM1555C1H180GA16D-Murata-datasheet-12511495.pdf?src-supplier=TME; ComponentLink4Description: https://datasheet.octopart.com/GCM1555C1H180GA16D-Murata-datasheet-12511495.pdf?src-supplier=TME; LCSC Part Number: C882583
FB1 FB2 = BLM15PG100SN1D: FERRITE BEAD 10 OHM 0402 1LN; Manufacturer: Murata; Material: Steel; Impedance: 10R; Current Rating: 1A; Number of Lines: 1; DC Resistance (DCR): 25mR; Shielding: Unshielded; Tolerance: 25%; Test Frequency: 100MHz; DC Resistance-Max: 50mR; Supplier 1: Arrow Electronics; Manufacturer Part Number: BLM15PG100SN1D; RoHS: Yes; Category: Ferrite Beads and Chips; Stock 1: 9684; Pricing 1: 1=0.10900, 10=0.06930, 25=0.05030, 50=0.04970, 100=0.03510, 250=0.03470, 500=0.03030, 1000=0.03000, 3000=0.02970, 6000=0.02640 (USD); Case/Package: 0402; Number of Pins: 2; Core Material: Ferrite; Case Code (Metric): 1005; Case Code (Imperial): 0402; Min Operating Temperature: -55°C; Max Operating Temperature: 125°C; Packaging: Tape and Reel; Number of Circuits: 1; Package Quantity: 1; Max Current Rating: 1A; Termination: SMD/SMT; Max DC Current: 1A; Series: BLM15PG; Length: 1mm; Width: 0.5mm; Height: 0.5mm; Depth: 0.55mm; REACH SVHC: No SVHC; Lead Free: Lead Free; RoHS Compliant: Yes; ComponentLink1URL: https://datasheet.ciiva.com/41449/001172209-da-01-en-drossel-0402-10r-1-0x0-5mm-10000st-41449496.pdf?src-supplier=Conrad; ComponentLink1Description: https://datasheet.ciiva.com/41449/001172209-da-01-en-drossel-0402-10r-1-0x0-5mm-10000st-41449496.pdf?src-supplier=Conrad; ComponentLink2URL: https://datasheet.ciiva.com/46423/1851892-46423898.pdf?src-supplier=Element14; ComponentLink2Description: https://datasheet.ciiva.com/46423/1851892-46423898.pdf?src-supplier=Element14; ComponentLink3URL: https://datasheet.ciiva.com/6211/l0110e-6211726.pdf?src-supplier=Digi-Key; ComponentLink3Description: https://datasheet.ciiva.com/6211/l0110e-6211726.pdf?src-supplier=Digi-Key; Supplier Part Number 1: BLM15PG100SN1D; LCSC Part Number: C85823; Item Type: Ferrite Bead
LED5 = NCD0603G2: Emerald 0603 Light Emitting Diodes (LED) ROHS; Manufacturer: Foshan NationStar Optoelectronics; Manufacturer Part Number: NCD0603G2; Package: 0603; LCSC Part Number: C87326; Item Type: LED; ComponentLink1Description: LCSC; ComponentLink1URL: https://www.lcsc.com/product-detail/Light-Emitting-Diodes-LED_Foshan-NationStar-Optoelectronics-NCD0603G2_C87326.html
LED6 = NCD0603R3: as LED1 on sheet Power_Sheet; Manufacturer Part Number: NCD0603R3; Package: 0603; Item Type: LED; LCSC Part Number: C3151730; ComponentLink1Description: LCSC; ComponentLink1URL: https://www.lcsc.com/product-detail/Light-Emitting-Diodes-LED_Foshan-NationStar-Optoelectronics-NCD0603R3_C3151730.html
R151 R160 R165 R167-R169 = RC0402FR-0710KL: as R12 on sheet Controller_Sheet; Supplier 1: Mouser; Manufacturer Part Number: RC0402FR-0710KL; RoHS: Yes; Category: Chip SMD Resistors; Stock 1: 18648329; Pricing 1: 1=0.10000, 10=0.01400, 50=0.01400, 100=0.00500, 1000=0.00300, 10000=0.00200 (USD); Case/Package: 0402; Number of Pins: 2; Case Code (Imperial): 0402; Case Code (Metric): 1005; Min Operating Temperature: -55°C; Max Operating Temperature: 155°C; Resistor Type: Thick Film; Tolerance: 1%; Packaging: Tape and Reel; Voltage Rating: 50V; Termination: SMD/SMT; Working Voltage: 50V; Number of Terminations: 2; Features: Moisture Resistant; Series: RC; Resistance Tolerance: 1%; Construction: Rectangular; Length: 1mm; Width: 0.5mm; Height: 0.32mm; Depth: 0.5mm; Lead Pitch: 0.2mm; REACH SVHC: No SVHC; Lead Free: Lead Free; RoHS Compliant: Yes; Military Standard: Not; ComponentLink1URL: https://datasheet.ciiva.com/7660/38568-7660787.pdf?src-supplier=Element14; ComponentLink1Description: https://datasheet.ciiva.com/7660/38568-7660787.pdf?src-supplier=Element14; ComponentLink2URL: https://datasheet.ciiva.com/7849/1686128-7849814.pdf?src-supplier=Element14; ComponentLink2Description: https://datasheet.ciiva.com/7849/1686128-7849814.pdf?src-supplier=Element14; ComponentLink3URL: https://datasheet.ciiva.com/7983/1018594-7983486.pdf?src-supplier=Element14; ComponentLink3Description: https://datasheet.ciiva.com/7983/1018594-7983486.pdf?src-supplier=Element14; ComponentLink4URL: https://datasheet.ciiva.com/22747/1018594-22747512.pdf?src-supplier=Element14; ComponentLink4Description: https://datasheet.ciiva.com/22747/1018594-22747512.pdf?src-supplier=Element14; ComponentLink5URL: https://datasheet.ciiva.com/12667/pyu-rc0402-51-rohs-l-6-r-12667067.pdf?src-supplier=Mouser; ComponentLink5Description: https://datasheet.ciiva.com/12667/pyu-rc0402-51-rohs-l-6-r-12667067.pdf?src-supplier=Mouser; ComponentLink6URL: https://datasheet.ciiva.com/7849/1784430-7849813.pdf?src-supplier=Element14; ComponentLink6Description: https://datasheet.ciiva.com/7849/1784430-7849813.pdf?src-supplier=Element14; ComponentLink7URL: https://datasheet.ciiva.com/7849/1784430-7849815.pdf?src-supplier=Element14; ComponentLink7Description: https://datasheet.ciiva.com/7849/1784430-7849815.pdf?src-supplier=Element14; Supplier Part Number 1: 603-RC0402FR-0710KL; LCSC Part Number: C60490
R161 = RT0402BRD0712K1L: RES SMD 12.1KOHM 0.1% 1/16W 0402; Manufacturer: Yageo; Item Type: Resistor; Supplier: Future Electronics; Supplier Part Number: 2068365; Manufacturer Part Number: RT0402BRD0712K1L; RoHS: Yes; Category: Chip SMD Resistors; Stock: 60000; Pricing: 10000=0.0245, 20000=0.0217, 30000=0.0237, 50000=0.0233, 100000=0.0228, 200000=0.022 (USD); ComponentLink1URL: https://datasheet.ciiva.com/12812/pyu-rt-1-to-0-05-rohs-l-4-12812462.pdf?src-supplier=Mouser; ComponentLink1Description: https://datasheet.ciiva.com/12812/pyu-rt-1-to-0-05-rohs-l-4-12812462.pdf?src-supplier=Mouser; LCSC Part Number: C281773
R162 R163 = RC0402FR-074K7L: as R23 on sheet RS485_RS232_Sheet; Supplier 1: Avnet; Manufacturer Part Number: RC0402FR-074K7L; RoHS: Yes; Category: Chip SMD Resistors; Stock 1: 2420000; Pricing 1: 10000=0.00085 (USD); Case/Package: 0402; Number of Pins: 2; Case Code (Imperial): 0402; Case Code (Metric): 1005; Size Code: 0402; Min Operating Temperature: -55°C; Max Operating Temperature: 155°C; Tolerance: 1%; Voltage Rating: 50V; Packaging: Tape and Reel; Resistor Type: Thick Film; Termination: SMD/SMT; Features: Moisture Resistant; Series: RC; Number of Terminations: 2; Resistance Tolerance: 1%; Construction: Rectangular; Length: 1mm; Width: 0.5mm; Height: 0.32mm; Depth: 0.5mm; Height - Seated (Max): 0.016inch; RoHS Compliant: Yes; Reach SVHC Compliant: Yes; Military Standard: Not; Lead Free: Lead Free; ComponentLink1URL: https://datasheet.ciiva.com/22661/1686128-22661342.pdf?src-supplier=Element14; ComponentLink1Description: https://datasheet.ciiva.com/22661/1686128-22661342.pdf?src-supplier=Element14; ComponentLink2URL: https://datasheet.ciiva.com/7850/1018594-7850022.pdf?src-supplier=Element14; ComponentLink2Description: https://datasheet.ciiva.com/7850/1018594-7850022.pdf?src-supplier=Element14; ComponentLink3URL: https://datasheet.ciiva.com/7850/1018594-7850023.pdf?src-supplier=Element14; ComponentLink3Description: https://datasheet.ciiva.com/7850/1018594-7850023.pdf?src-supplier=Element14; ComponentLink4URL: https://datasheet.ciiva.com/15215/getdatasheetpartid-328119-15215035.pdf?src-supplier=Verical; ComponentLink4Description: https://datasheet.ciiva.com/15215/getdatasheetpartid-328119-15215035.pdf?src-supplier=Verical; Supplier Part Number 1: RC0402FR-074K7L; LCSC Part Number: C105871
R164 R166 = RC0603JR-07330RL: RES  SMD 330R 100 mW 0603; Manufacturer: Yageo; Power Rating: 100mW; Tolerance: 5%; Voltage Rating (DC): 50V; Temperature Coefficient: 100ppm/°C; Item Type: Resistor; Supplier 1: Digi-Key; Manufacturer Part Number: RC0603JR-07330RL; RoHS: Yes; Category: Chip SMD Resistors; Stock 1: 1074593; Pricing 1: 1=0.10000, 10=0.02000, 100=0.00800, 1000=0.00360, 2500=0.00312 (USD); Case/Package: 0603; Number of Pins: 2; Case Code (Imperial): 0603; Case Code (Metric): 1608; Size Code: 0603; Min Operating Temperature: -55°C; Max Operating Temperature: 155°C; Resistance: 330R; Packaging: Tape and Reel; Voltage Rating: 50V; Package Quantity: 5000; Termination: SMD/SMT; Resistor Type: Thick Film; Features: Moisture Resistant; Series: RC; Max Power Dissipation: 100mW; Number of Terminations: 2; Resistance Tolerance: 5%; Construction: Rectangular; Length: 1.6mm; Width: 0.8mm; Height: 0.45mm; Depth: 0.8mm; REACH SVHC: No SVHC; Lead Free: Lead Free; Military Standard: Not; RoHS Compliant: Yes; Supplier Part Number 1: 311-330GRCT-ND; LCSC Part Number: C105879
SW6 = B3U-1000P: as SW1 on sheet Controller_Sheet; ComponentLink1URL: http://www.farnell.com/datasheets/60838.pdf?src-supplier=Farnell; ComponentLink1Description: http://www.farnell.com/datasheets/60838.pdf?src-supplier=Farnell; ComponentLink2URL: http://www.farnell.com/datasheets/60838.pdf?src-supplier=Element14; ComponentLink2Description: http://www.farnell.com/datasheets/60838.pdf?src-supplier=Element14; ComponentLink3URL: https://omronfs.omron.com/en_US/ecb/products/pdf/en-b3u.pdf?src-supplier=Digi-Key; ComponentLink3Description: https://omronfs.omron.com/en_US/ecb/products/pdf/en-b3u.pdf?src-supplier=Digi-Key; ComponentLink4URL: http://www.omron.com/ecb/products/pdf/en-b3u.pdf?src-supplier=Digi-Key; ComponentLink4Description: http://www.omron.com/ecb/products/pdf/en-b3u.pdf?src-supplier=Digi-Key; ComponentLink5URL: https://www.distrelec.biz/Web/Downloads/he/et/B3U_eng_datasheet.pdf?mime=application%2Fpdf&src-supplier=Distrelec; ComponentLink5Description: https://www.distrelec.biz/Web/Downloads/he/et/B3U_eng_datasheet.pdf?mime=application%2Fpdf&src-supplier=Distrelec; ComponentLink6URL: http://www.onlinecomponents.com/productFiles/mf-OM/en-b3u.pdf?src-supplier=Onlinecomponents.com; ComponentLink6Description: http://www.onlinecomponents.com/productFiles/mf-OM/en-b3u.pdf?src-supplier=Onlinecomponents.com; Supplier 1: Digi-Key; Manufacturer Part Number: B3U-1000P; Stock 1: 116454; Pricing 1: 1=1, 10=0.961, 25=0.9064, 50=0.7976, 100=0.7251, 250=0.68888, 500=0.67074, 1000=0.52571 (USD); Mount: Surface Mount; Weight: 0.000776oz; Contact Material: Silver; Min Operating Temperature: -25°C; Max Operating Temperature: 70°C; Packaging: Tape and Reel; Voltage Rating (DC): 12V; Package Quantity: 1; Max Current Rating: 50mA; Termination: SMD/SMT; Orientation: Straight; Max Voltage Rating (DC): 12V; Electrical Life: 200000Cycles; Insulation Resistance: 100MR; Contact Current Rating: 50mA; Length: 4mm; Height: 1.2mm; Depth: 2.5mm; Width: 3mm; REACH SVHC: Unknown; Lead Free: Lead Free; ComponentLink7URL: https://www.verical.com/server-webapp/html/getDatasheet?partID=552554&src-supplier=Verical; ComponentLink7Description: https://www.verical.com/server-webapp/html/getDatasheet?partID=552554&src-supplier=Verical; ComponentLink8URL: http://www.farnell.com/datasheets/1685550.pdf?src-supplier=Element14; ComponentLink8Description: http://www.farnell.com/datasheets/1685550.pdf?src-supplier=Element14; ComponentLink9URL: http://www.farnell.com/datasheets/2610940.pdf?src-supplier=Farnell; ComponentLink9Description: http://www.farnell.com/datasheets/2610940.pdf?src-supplier=Farnell; ComponentLink10URL: https://www.alliedelec.com/m/d/4c8a9ef82804fc3c241a13c1e298fd73.pdf?src-supplier=Allied+Electronics; ComponentLink10Description: https://www.alliedelec.com/m/d/4c8a9ef82804fc3c241a13c1e298fd73.pdf?src-supplier=Allied+Electronics; Supplier Part Number 1: SW1020DKR-ND; LCSC Part Number: C231329; Item Type: Switch
TP4 = TEST POINT: Test Point ON; Item Type: TEST POINT
U19 = LAN9253-SVB QFN64: 2/3-PORT ETHERCAT SLAVE CTLR; Manufacturer: Microchip; Manufacturer Part Number: LAN9253-I/R4X; Item Type: IC; Revision: 2; ComponentLink1Description: SVN Datasheet; ComponentLink2Description: Local Datasheet; ComponentLink5Description: Open Footprint 2; ComponentLink6Description: Open Footprint 3; Supplier: Digikey; Supplier Part Number: 150-LAN9253-I/R4X-ND; RoHS: Yes; Stock: 364; Pricing: 1=13.43, 25=11.2, 100=10.825 (USD)
X11 = X322525MRB4SI: 25MHz 贴片晶振 18pF ±10ppm ±20ppm SMD3225-4P Crystals ROHS; Manufacturer: YXC; Supplier: LCSC; LCSC Part Number: C70593; Manufacturer Part Number: X322525MRB4SI; RoHS: No; Item Type: Crystal